# Altium schematic sheet 02_RF.SchDoc
size 297 x 209 mm; Page Create Date: March  8, 1995; Page Number: 2; Page Size: A4; Reviewer: Default; Page Count: 5; Designer: Dennis; Page Name: 02_RF; RevCode: 1.0; DsnPath: H:\PCB\2026\狼王傻波一\20260204_V0_ELRS-RX\ELRS-RX-MODULE-V11\ELRS-RX-MODULE-V11-20260127.DSN; SchematicName: SCHEMATIC1; PageName: 02_RF; PageSize: A4; TopSchematic: True
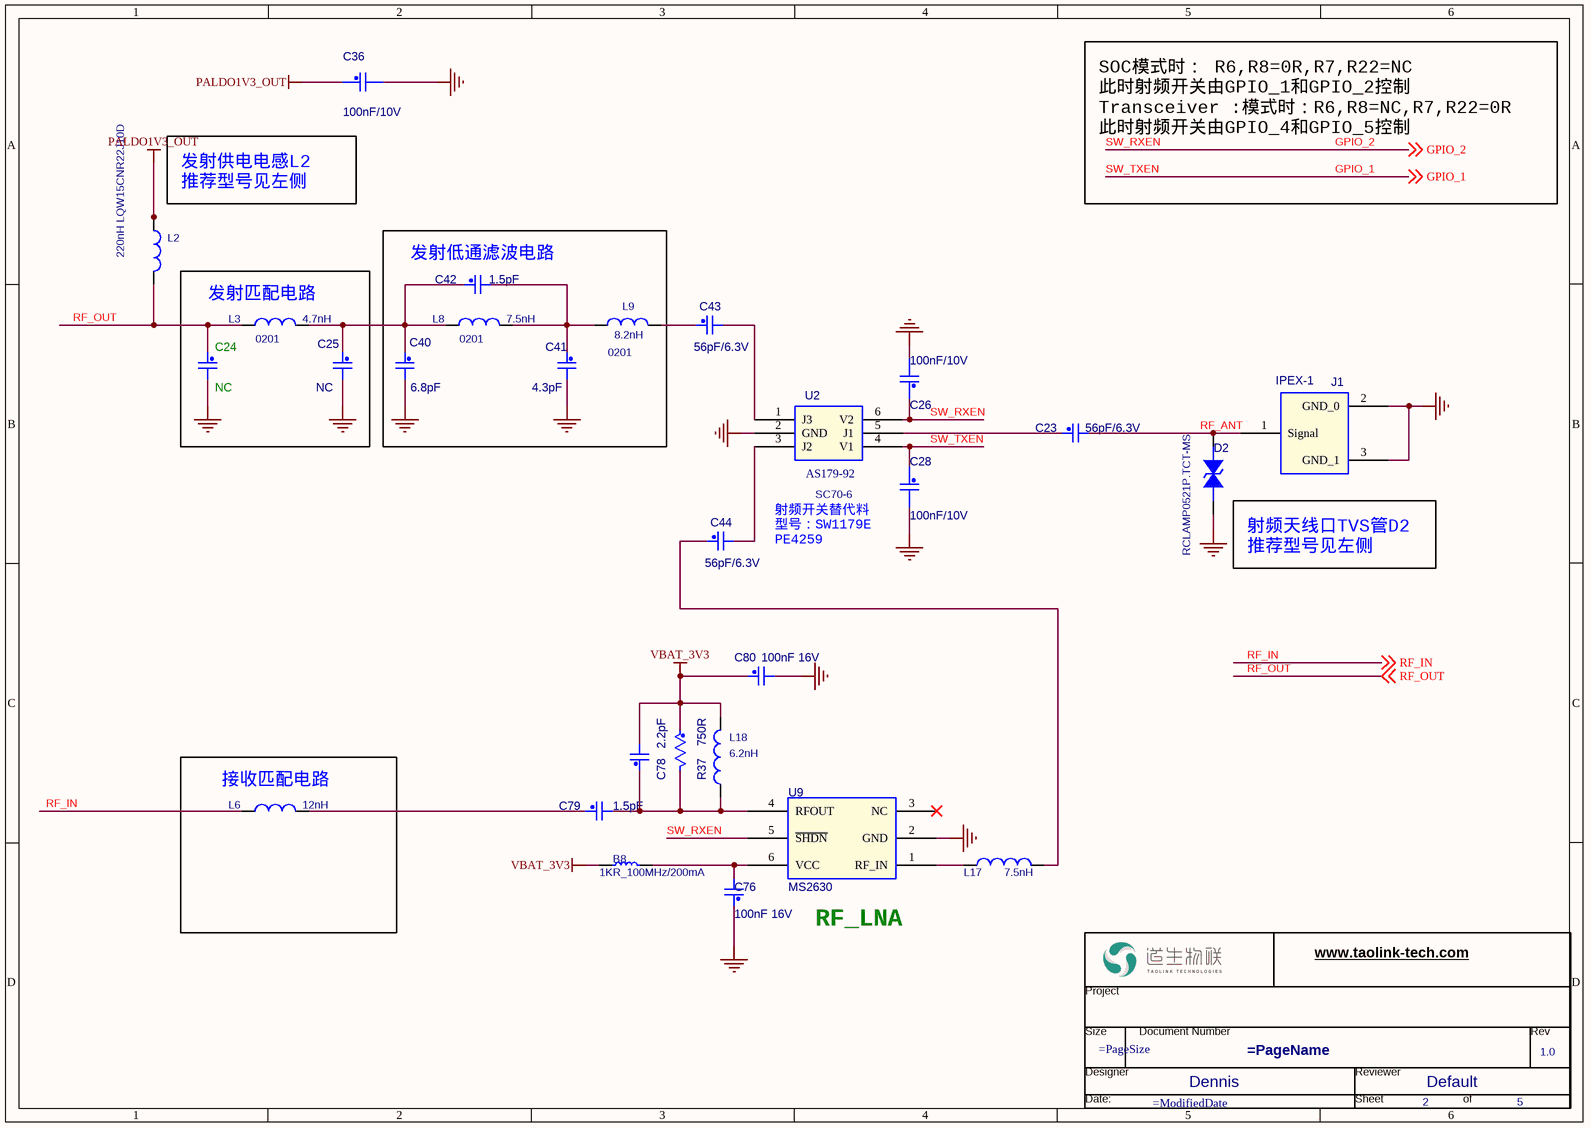
[diagram p0: 02_RF.SchDoc]

## Parts
*  RevCode: 1.0  Designer: Dennis  Reviewer: Default  Page Number: 2  Page Count: 5  (graphical)
B8  1KR_100MHz/200mA  [0201]
C23  56pF/6.3V  [0201]
C24  NC  [0201]
C25  NC  [0201]
C26  100nF/10V  [0201]
C28  100nF/10V  [0201]
C36  100nF/10V  [0201]
C40  6.8pF  [0201]
C41  4.3pF  [0201]
C42  1.5pF  [0201]
C43  56pF/6.3V  [0201]
C44  56pF/6.3V  [0201]
C76  100nF 16V  [0201]
C78  2.2pF  [0201]
C79  1.5pF  [0201]
C80  100nF 16V  [0201]
D2  RCLAMP0521P.TCT-MS  [TVS-0402]
J1  IPEX-1  [IPEX-1]
L2  220nH LQW15CNR22J10D  [L0402]
L3  4.7nH  [0201]
L6  12nH  [0201]
L8  7.5nH  [0201]
L9  8.2nH  [0201]
L17  7.5nH  [0201]
L18  6.2nH  [0201]
R37  750R  [0201]
U2  AS179-92  [SC70-6]
U9  MS2630  [SOT23-6]

## Blocks framed on the sheet
发射匹配电路: C24 C25 L3
发射低通滤波电路: C40-C42 L8 L9
接收匹配电路: L6

## Nets
GND: C24.2 C25.2 C26.2 C28.2 C36.2 C40.2 C41.2 C76.1 C80.2 D2.2(CATHODE) J1.2(GND_0) J1.3(GND_1) U2.2(GND) U9.2(GND)
PALDO1V3_OUT: C36.1 L2.1
VBAT_3V3: B8.2 C78.2 C80.1 L18.2 R37.1
GPIO_1: C28.1 U2.4(V1) ; off-sheet GPIO_1  [also labelled SW_TXEN]
GPIO_2: C26.1 U2.6(V2) U9.5(~{SHDN}) ; off-sheet GPIO_2  [also labelled SW_RXEN]
RF_ANT: C23.2 D2.1(ANODE) J1.1(Signal)
RF_IN: L6.1 ; off-sheet RF_IN
RF_OUT: C24.1 L2.2 L3.1 ; off-sheet RF_OUT
NetB8_1: B8.1 C76.2 U9.6(VCC)
NetC23_1: C23.1 U2.5(J1)
NetC25_1: C25.1 C40.1 C42.1 L3.2 L8.1
NetC41_1: C41.1 C42.2 L8.2 L9.1
NetC43_1: C43.1 L9.2
NetC43_2: C43.2 U2.1(J3)
NetC44_1: C44.1 L17.2
NetC44_2: C44.2 U2.3(J2)
NetC78_1: C78.1 C79.2 L18.1 R37.2 U9.4(RFOUT)
NetC79_1: C79.1 L6.2
NetL17_1: L17.1 U9.1(RF_IN)

Not connected (* = marked no-connect by the designer): U9 3(NC)*

## Notes on the sheet
- SOC模式时： R6,R8=0R,R7,R22=NC
  此时射频开关由GPIO_1和GPIO_2控制
  Transceiver :模式时：R6,R8=NC,R7,R22=0R
  此时射频开关由GPIO_4和GPIO_5控制
- 发射供电电感L2
  推荐型号见左侧
- (near C28) 射频开关替代料
  型号：SW1179E
  PE4259
- 射频天线口TVS管D2
  推荐型号见左侧
- (near U9) RF_LNA
- (in symbol TaoLin_DesignName) www.taolink-tech.com; Project; Size; Document Number; Rev; Designer; Reviewer; Date:; Sheet; of

## Library data of the parts
* = TaoLin_DesignName: Page Create Date: March  8, 1995; Page Size: =PageSize; Page Name: =PageName; Page Modify Date: =ModifiedDate
B8 = INDUCTOR_Dup1: Part Reference: B8; Reviewed2: LBY; FPLIST: 0402R_S,0402R,0402R_M,0402R_MIN,R0402; 存货简称: TURBO; 型号: 1.5K 1%; 规格: 贴装碳膜电阻器－1.5KR－±1%－1/16W－0402; 存货名称: 贴片电阻; 存货编码: 040101070; Value: 1KR_100MHz/200mA; PCB Footprint: 0201
C23 = Ceramic Capacitor: Ceramic Capacitor,22uF,6.3V,+/-20%,X5R,0603,Samsung; Part Reference: C23; Manufacturer P/N: CL10A226MQ8NRNC; Myir P/N: 20401.00086; Value: 56pF/6.3V; PCB Footprint: 0201; Part Type: Ceramic Capacitor; Manufacturer: Samsung; Reserve Value: 22uF; Datasheet: Samsung.pdf
C24 = Ceramic Capacitor: Ceramic Capacitor,22uF,6.3V,+/-20%,X5R,0603,Samsung; Part Reference: C24; Manufacturer P/N: CL10A226MQ8NRNC; Myir P/N: 20401.00086; Value: NC; PCB Footprint: 0201; Part Type: Ceramic Capacitor; Manufacturer: Samsung; Reserve Value: 22uF; Datasheet: Samsung.pdf
C25 = Ceramic Capacitor: Ceramic Capacitor,22uF,6.3V,+/-20%,X5R,0603,Samsung; Part Reference: C25; Manufacturer P/N: CL10A226MQ8NRNC; Myir P/N: 20401.00086; Value: NC; PCB Footprint: 0201; Part Type: Ceramic Capacitor; Manufacturer: Samsung; Reserve Value: 22uF; Datasheet: Samsung.pdf
C26 = Ceramic Capacitor_14: Ceramic Capacitor,100nF,50V,+/-10%,X7R,0402,Fenghua; Part Reference: C26; Manufacturer P/N: 0402B104K500NT; Myir P/N: 2040180111; Value: 100nF/10V; PCB Footprint: 0201; Part Type: Ceramic Capacitor; Manufacturer: Fenghua; Reserve Value: 100nF; Datasheet: 附件7 风华片容全系列承认书.pdf
C28 = Ceramic Capacitor_14: Ceramic Capacitor,100nF,50V,+/-10%,X7R,0402,Fenghua; Part Reference: C28; Manufacturer P/N: 0402B104K500NT; Myir P/N: 2040180111; Value: 100nF/10V; PCB Footprint: 0201; Datasheet: 附件7 风华片容全系列承认书.pdf; Reserve Value: 100nF; Manufacturer: Fenghua; Part Type: Ceramic Capacitor
C36 = Ceramic Capacitor_14: Ceramic Capacitor,100nF,50V,+/-10%,X7R,0402,Fenghua; Part Reference: C36; Manufacturer P/N: 0402B104K500NT; Myir P/N: 2040180111; Value: 100nF/10V; PCB Footprint: 0201; Part Type: Ceramic Capacitor; Manufacturer: Fenghua; Reserve Value: 100nF; Datasheet: 附件7 风华片容全系列承认书.pdf
C40 = Ceramic Capacitor: Ceramic Capacitor,22uF,6.3V,+/-20%,X5R,0603,Samsung; Part Reference: C40; Manufacturer P/N: CL10A226MQ8NRNC; Myir P/N: 20401.00086; Value: 6.8pF; PCB Footprint: 0201; Datasheet: Samsung.pdf; Reserve Value: 22uF; Manufacturer: Samsung; Part Type: Ceramic Capacitor
C41 = Ceramic Capacitor: Ceramic Capacitor,22uF,6.3V,+/-20%,X5R,0603,Samsung; Part Reference: C41; Manufacturer P/N: CL10A226MQ8NRNC; Myir P/N: 20401.00086; Value: 4.3pF; PCB Footprint: 0201; Datasheet: Samsung.pdf; Reserve Value: 22uF; Manufacturer: Samsung; Part Type: Ceramic Capacitor
C42 = Ceramic Capacitor: Ceramic Capacitor,22uF,6.3V,+/-20%,X5R,0603,Samsung; Part Reference: C42; Manufacturer P/N: CL10A226MQ8NRNC; Myir P/N: 20401.00086; Value: 1.5pF; PCB Footprint: 0201; Part Type: Ceramic Capacitor; Manufacturer: Samsung; Reserve Value: 22uF; Datasheet: Samsung.pdf
C43 = Ceramic Capacitor: Ceramic Capacitor,22uF,6.3V,+/-20%,X5R,0603,Samsung; Part Reference: C43; Manufacturer P/N: CL10A226MQ8NRNC; Myir P/N: 20401.00086; Value: 56pF/6.3V; PCB Footprint: 0201; Datasheet: Samsung.pdf; Reserve Value: 22uF; Manufacturer: Samsung; Part Type: Ceramic Capacitor
C44 = Ceramic Capacitor: Ceramic Capacitor,22uF,6.3V,+/-20%,X5R,0603,Samsung; Part Reference: C44; Manufacturer P/N: CL10A226MQ8NRNC; Myir P/N: 20401.00086; Value: 56pF/6.3V; PCB Footprint: 0201; Part Type: Ceramic Capacitor; Manufacturer: Samsung; Reserve Value: 22uF; Datasheet: Samsung.pdf
C76 = Ceramic Capacitor: Ceramic Capacitor,22uF,6.3V,+/-20%,X5R,0603,Samsung; Part Reference: C76; Manufacturer P/N: CL10A226MQ8NRNC; Myir P/N: 20401.00086; Value: 100nF 16V; Datasheet: Samsung.pdf; Reserve Value: 22uF; Manufacturer: Samsung; Part Type: Ceramic Capacitor; PCB Footprint: 0201
C78 = Ceramic Capacitor: Ceramic Capacitor,22uF,6.3V,+/-20%,X5R,0603,Samsung; Part Reference: C78; Manufacturer P/N: CL10A226MQ8NRNC; Myir P/N: 20401.00086; Value: 2.2pF; PCB Footprint: 0201; Part Type: Ceramic Capacitor; Manufacturer: Samsung; Reserve Value: 22uF; Datasheet: Samsung.pdf
C79 = Ceramic Capacitor: Ceramic Capacitor,22uF,6.3V,+/-20%,X5R,0603,Samsung; Part Reference: C79; Manufacturer P/N: CL10A226MQ8NRNC; Myir P/N: 20401.00086; Value: 1.5pF; PCB Footprint: 0201; Part Type: Ceramic Capacitor; Manufacturer: Samsung; Reserve Value: 22uF; Datasheet: Samsung.pdf
C80 = Ceramic Capacitor: Ceramic Capacitor,22uF,6.3V,+/-20%,X5R,0603,Samsung; Part Reference: C80; Manufacturer P/N: CL10A226MQ8NRNC; Myir P/N: 20401.00086; Value: 100nF 16V; PCB Footprint: 0201; Datasheet: Samsung.pdf; Reserve Value: 22uF; Manufacturer: Samsung; Part Type: Ceramic Capacitor
D2 = TVS: Part Reference: D2; Value: RCLAMP0521P.TCT-MS; PCB Footprint: TVS-0402
J1 = IPEX-1: Part Reference: J1; Value: IPEX-1; PCB Footprint: IPEX-1
L2 = INDUCTOR_Dup2: Part Reference: L2; Value: 220nH LQW15CNR22J10D; PCB Footprint: L0402
L3 = INDUCTOR_Dup2: Part Reference: L3; Value: 4.7nH; PCB Footprint: 0201
L6 = INDUCTOR_Dup2: Part Reference: L6; Value: 12nH; PCB Footprint: 0201
L8 = INDUCTOR_Dup2: Part Reference: L8; Value: 7.5nH; PCB Footprint: 0201
L9 = INDUCTOR_Dup2: Part Reference: L9; Value: 8.2nH; PCB Footprint: 0201
L17 = INDUCTOR: Part Reference: L17; Value: 7.5nH; PCB Footprint: 0201
L18 = INDUCTOR: Part Reference: L18; Value: 6.2nH; PCB Footprint: 0201
R37 = Resister: Thick Film Resistor,0R,+/-5%,1/16W,-55°C ~ 155°C,SMD,0402,Fenghua; Part Reference: R37; Manufacturer P/N: RC-02000JT; Myir P/N: 20301.00186; Value: 750R; PCB Footprint: 0201; Part Type: Thick Film Resistor; Manufacturer: Fenghua; Reserve Value: 0R; Datasheet: FH规格书_2018-07-30.pdf
U2 = AS179-92: Part Reference: U2; Value: AS179-92; PCB Footprint: SC70-6
U9 = MS2630: Part Reference: U9; Value: MS2630; PCB Footprint: SOT23-6